# Altium project PCB_Project1.PrjPCB
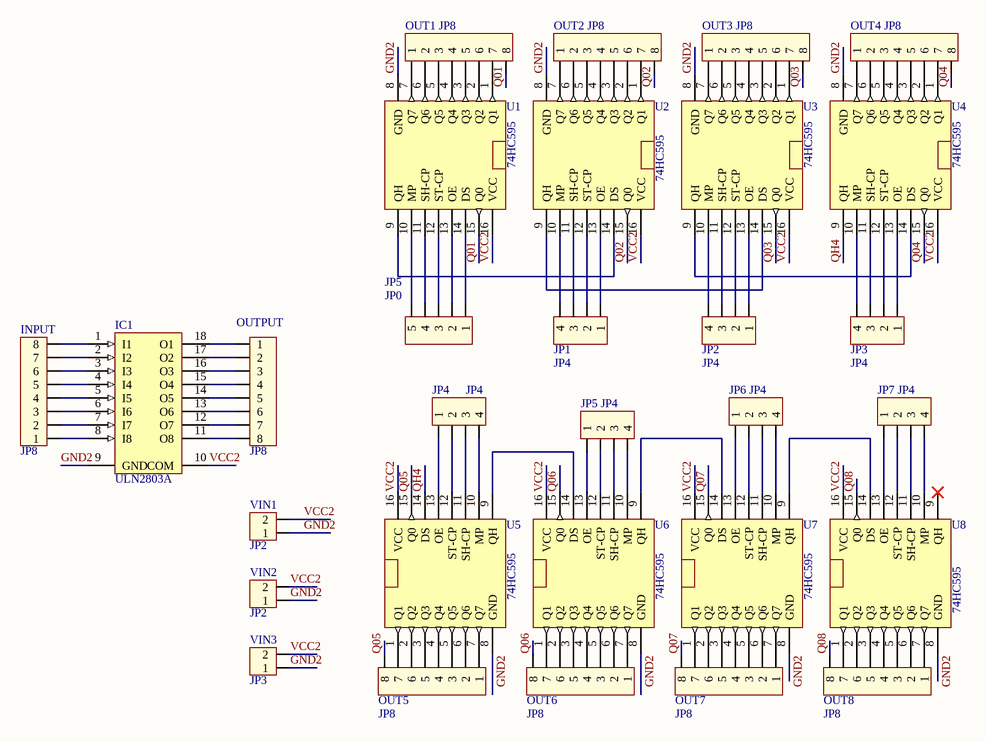
[diagram p0: MACH.SchDoc]
1 sheet, 30 parts. Net scope: global (net labels, ports and power ports of the same name join across sheets).
Board files: PCB1.PcbDoc, LED8x8x8.PcbDoc

## Sheet MACH.SchDoc
size A3

### Parts
IC1  ULN2803A  [DIP18/W0.3]
INPUT  JP8  [CON8]
JP0  JP5  [CON5]
JP1  JP4  [CON4]
JP2  JP4  [CON4]
JP3  JP4  [CON4]
JP4  JP4  [CON4]
JP5  JP4  [CON4]
JP6  JP4  [CON4]
JP7  JP4  [CON4]
OUT1  JP8  [CON8]
OUT2  JP8  [CON8]
OUT3  JP8  [CON8]
OUT4  JP8  [CON8]
OUT5  JP8  [CON8]
OUT6  JP8  [CON8]
OUT7  JP8  [CON8]
OUT8  JP8  [CON8]
OUTPUT  JP8  [CON8]
U1  74HC595  [SOP16]
U2  74HC595  [SOP16]
U3  74HC595  [SOP16]
U4  74HC595  [SOP16]
U5  74HC595  [SOP16]
U6  74HC595  [SOP16]
U7  74HC595  [SOP16]
U8  74HC595  [SOP16]
VIN1  JP2  [CON2]
VIN2  JP2  [CON2]
VIN3  JP3  [CON2]

### Nets
GND2: IC1.9(GND) U1.8(GND) U2.8(GND) U3.8(GND) U4.8(GND) U5.8(GND) U6.8(GND) U7.8(GND) U8.8(GND) VIN1.1 VIN2.1 VIN3.1
Q01: OUT1.8 U1.15(Q0)
Q02: OUT2.8 U2.15(Q0)
Q03: OUT3.8 U3.15(Q0)
Q04: OUT4.8 U4.15(Q0)
Q05: OUT5.8 U5.15(Q0)
Q06: OUT6.8 U6.15(Q0)
Q07: OUT7.8 U7.15(Q0)
Q08: OUT8.8 U8.15(Q0)
QH4: U4.9(QH) U5.14(DS)
VCC2: IC1.10(COM) U1.16(VCC) U2.16(VCC) U3.16(VCC) U4.16(VCC) U5.16(VCC) U6.16(VCC) U7.16(VCC) U8.16(VCC) VIN1.2 VIN2.2 VIN3.2
NetIC1_1: IC1.1(I1) INPUT.8
NetIC1_2: IC1.2(I2) INPUT.7
NetIC1_3: IC1.3(I3) INPUT.6
NetIC1_4: IC1.4(I4) INPUT.5
NetIC1_5: IC1.5(I5) INPUT.4
NetIC1_6: IC1.6(I6) INPUT.3
NetIC1_7: IC1.7(I7) INPUT.2
NetIC1_8: IC1.8(I8) INPUT.1
NetIC1_11: IC1.11(O8) OUTPUT.8
NetIC1_12: IC1.12(O7) OUTPUT.7
NetIC1_13: IC1.13(O6) OUTPUT.6
NetIC1_14: IC1.14(O5) OUTPUT.5
NetIC1_15: IC1.15(O4) OUTPUT.4
NetIC1_16: IC1.16(O3) OUTPUT.3
NetIC1_17: IC1.17(O2) OUTPUT.2
NetIC1_18: IC1.18(O1) OUTPUT.1
NetJP0_1: JP0.1 U1.14(DS)
NetJP0_2: JP0.2 U1.13(OE)
NetJP0_3: JP0.3 U1.12(ST-CP)
NetJP0_4: JP0.4 U1.11(SH-CP)
NetJP0_5: JP0.5 U1.10(MP)
NetJP1_1: JP1.1 U2.13(OE)
NetJP1_2: JP1.2 U2.12(ST-CP)
NetJP1_3: JP1.3 U2.11(SH-CP)
NetJP1_4: JP1.4 U2.10(MP)
NetJP2_1: JP2.1 U3.13(OE)
NetJP2_2: JP2.2 U3.12(ST-CP)
NetJP2_3: JP2.3 U3.11(SH-CP)
NetJP2_4: JP2.4 U3.10(MP)
NetJP3_1: JP3.1 U4.13(OE)
NetJP3_2: JP3.2 U4.12(ST-CP)
NetJP3_3: JP3.3 U4.11(SH-CP)
NetJP3_4: JP3.4 U4.10(MP)
NetJP4_1: JP4.1 U5.13(OE)
NetJP4_2: JP4.2 U5.12(ST-CP)
NetJP4_3: JP4.3 U5.11(SH-CP)
NetJP4_4: JP4.4 U5.10(MP)
NetJP5_1: JP5.1 U6.13(OE)
NetJP5_2: JP5.2 U6.12(ST-CP)
NetJP5_3: JP5.3 U6.11(SH-CP)
NetJP5_4: JP5.4 U6.10(MP)
NetJP6_1: JP6.1 U7.13(OE)
NetJP6_2: JP6.2 U7.12(ST-CP)
NetJP6_3: JP6.3 U7.11(SH-CP)
NetJP6_4: JP6.4 U7.10(MP)
NetJP7_1: JP7.1 U8.13(OE)
NetJP7_2: JP7.2 U8.12(ST-CP)
NetJP7_3: JP7.3 U8.11(SH-CP)
NetJP7_4: JP7.4 U8.10(MP)
NetOUT1_1: OUT1.1 U1.7(Q7)
NetOUT1_2: OUT1.2 U1.6(Q6)
NetOUT1_3: OUT1.3 U1.5(Q5)
NetOUT1_4: OUT1.4 U1.4(Q4)
NetOUT1_5: OUT1.5 U1.3(Q3)
NetOUT1_6: OUT1.6 U1.2(Q2)
NetOUT1_7: OUT1.7 U1.1(Q1)
NetOUT2_1: OUT2.1 U2.7(Q7)
NetOUT2_2: OUT2.2 U2.6(Q6)
NetOUT2_3: OUT2.3 U2.5(Q5)
NetOUT2_4: OUT2.4 U2.4(Q4)
NetOUT2_5: OUT2.5 U2.3(Q3)
NetOUT2_6: OUT2.6 U2.2(Q2)
NetOUT2_7: OUT2.7 U2.1(Q1)
NetOUT3_1: OUT3.1 U3.7(Q7)
NetOUT3_2: OUT3.2 U3.6(Q6)
NetOUT3_3: OUT3.3 U3.5(Q5)
NetOUT3_4: OUT3.4 U3.4(Q4)
NetOUT3_5: OUT3.5 U3.3(Q3)
NetOUT3_6: OUT3.6 U3.2(Q2)
NetOUT3_7: OUT3.7 U3.1(Q1)
NetOUT4_1: OUT4.1 U4.7(Q7)
NetOUT4_2: OUT4.2 U4.6(Q6)
NetOUT4_3: OUT4.3 U4.5(Q5)
NetOUT4_4: OUT4.4 U4.4(Q4)
NetOUT4_5: OUT4.5 U4.3(Q3)
NetOUT4_6: OUT4.6 U4.2(Q2)
NetOUT4_7: OUT4.7 U4.1(Q1)
NetOUT5_1: OUT5.1 U5.7(Q7)
NetOUT5_2: OUT5.2 U5.6(Q6)
NetOUT5_3: OUT5.3 U5.5(Q5)
NetOUT5_4: OUT5.4 U5.4(Q4)
NetOUT5_5: OUT5.5 U5.3(Q3)
NetOUT5_6: OUT5.6 U5.2(Q2)
NetOUT5_7: OUT5.7 U5.1(Q1)
NetOUT6_1: OUT6.1 U6.7(Q7)
NetOUT6_2: OUT6.2 U6.6(Q6)
NetOUT6_3: OUT6.3 U6.5(Q5)
NetOUT6_4: OUT6.4 U6.4(Q4)
NetOUT6_5: OUT6.5 U6.3(Q3)
NetOUT6_6: OUT6.6 U6.2(Q2)
NetOUT6_7: OUT6.7 U6.1(Q1)
NetOUT7_1: OUT7.1 U7.7(Q7)
NetOUT7_2: OUT7.2 U7.6(Q6)
NetOUT7_3: OUT7.3 U7.5(Q5)
NetOUT7_4: OUT7.4 U7.4(Q4)
NetOUT7_5: OUT7.5 U7.3(Q3)
NetOUT7_6: OUT7.6 U7.2(Q2)
NetOUT7_7: OUT7.7 U7.1(Q1)
NetOUT8_1: OUT8.1 U8.7(Q7)
NetOUT8_2: OUT8.2 U8.6(Q6)
NetOUT8_3: OUT8.3 U8.5(Q5)
NetOUT8_4: OUT8.4 U8.4(Q4)
NetOUT8_5: OUT8.5 U8.3(Q3)
NetOUT8_6: OUT8.6 U8.2(Q2)
NetOUT8_7: OUT8.7 U8.1(Q1)
NetU1_9: U1.9(QH) U2.14(DS)
NetU2_9: U2.9(QH) U3.14(DS)
NetU3_9: U3.9(QH) U4.14(DS)
NetU5_9: U5.9(QH) U6.14(DS)
NetU6_9: U6.9(QH) U7.14(DS)
NetU7_9: U7.9(QH) U8.14(DS)

Not connected (* = marked no-connect by the designer): U8 9(QH)*

### Notes on the sheet
- Title
- Size:
- Date:
- A3
- Number:
- Time:
- Revision:
- Sheet
- of
- File:

### Library data of the parts
IC1 = ULN2803A: High-Voltage, High-Current Darlington Array; LatestRevisionNote: Stylized 3D Model Added.; Publisher: Altium Limited; Value: ULN2803A
INPUT OUT1-OUT8 OUTPUT = Con8: Connector 8; Value: Connector 8
JP0 = Con5: Connector 5; Value: Connector 5
JP1-JP7 = Con4: Connector 4; Value: Connector 4
VIN1-VIN3 = Con2: Connector 2; Value: Connector 2